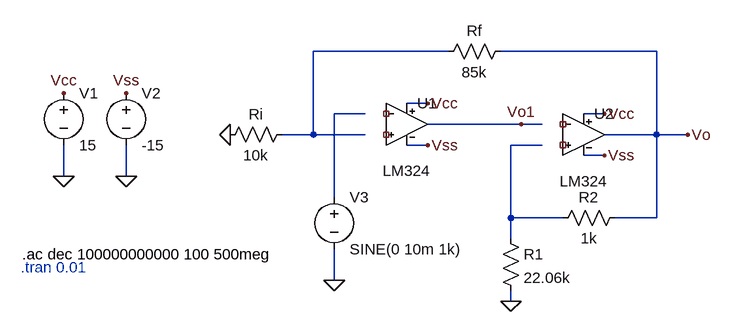
[diagram p0: schematic VFA-VFA.asc]
VFA-VFA.asc, the LTspice schematic file:
Version 4
SHEET 1 880 680
WIRE 192 32 -16 32
WIRE 512 32 272 32
WIRE 160 112 128 112
WIRE 64 128 16 128
WIRE 432 128 400 128
WIRE 304 144 160 144
WIRE 336 144 304 144
WIRE -16 160 -16 32
WIRE -16 160 -64 160
WIRE 64 160 -16 160
WIRE 512 160 512 32
WIRE 512 160 432 160
WIRE 560 160 512 160
WIRE 160 176 128 176
WIRE 336 176 288 176
WIRE 432 192 400 192
WIRE -400 224 -400 176
WIRE -304 224 -304 176
WIRE 16 256 16 128
WIRE 288 288 288 176
WIRE 368 288 288 288
WIRE 512 288 512 160
WIRE 512 288 448 288
WIRE 288 320 288 288
WIRE 16 384 16 336
WIRE 288 416 288 400
FLAG 288 416 0
FLAG -144 160 0
FLAG 16 384 0
FLAG -400 224 0
FLAG -304 224 0
FLAG -400 96 Vcc
FLAG 160 112 Vcc
FLAG 432 128 Vcc
FLAG -304 96 Vss
FLAG 160 176 Vss
FLAG 432 192 Vss
FLAG 560 160 Vo
FLAG 304 144 Vo1
SYMBOL res 272 304 R0
SYMATTR InstName R1
SYMATTR Value 22.06k
SYMBOL res 464 272 R90
WINDOW 0 0 56 VBottom 2
WINDOW 3 32 56 VTop 2
SYMATTR InstName R2
SYMATTR Value 1k
SYMBOL res 288 16 R90
WINDOW 0 0 56 VBottom 2
WINDOW 3 32 56 VTop 2
SYMATTR InstName Rf
SYMATTR Value 85k
SYMBOL res -48 144 R90
WINDOW 0 0 56 VBottom 2
WINDOW 3 32 56 VTop 2
SYMATTR InstName Ri
SYMATTR Value 10k
SYMBOL voltage -400 80 R0
WINDOW 123 0 0 Left 0
WINDOW 39 0 0 Left 0
SYMATTR InstName V1
SYMATTR Value 15
SYMBOL voltage -304 80 R0
WINDOW 123 0 0 Left 0
WINDOW 39 0 0 Left 0
SYMATTR InstName V2
SYMATTR Value -15
SYMBOL voltage 16 240 R0
WINDOW 39 0 0 Left 0
SYMATTR Value2 AC 1.05
SYMATTR InstName V3
SYMATTR Value SINE(0 10m 1k)
SYMBOL AutoGenerated\\LM324 128 144 R0
SYMATTR InstName U1
SYMBOL AutoGenerated\\LM324 400 160 R0
SYMATTR InstName U2
TEXT -464 344 Left 2 !.ac dec 100000000000 100 500meg
TEXT -466 364 Left 2 ;.tran 0.01

The netlist it stands for:
* VFA-VFA.asc
R1 N003 0 22.06k
R2 Vo N003 1k
Rf Vo N001 85k
Ri N001 0 10k
V1 Vcc 0 15
V2 Vss 0 -15
V3 N002 0 SINE(0 10m 1k) AC 1.05
XU1 NC_01 NC_02 Vcc Vss Vo1 LM324  ; pins In+ In- V+ V- OUT
XU2 NC_03 NC_04 Vcc Vss Vo LM324  ; pins In+ In- V+ V- OUT
.ac dec 100000000000 100 500meg
* .tran 0.01
.lib E:\LtSpice_components\LM324.ti.lib
.backanno
.end